# EAGLE schematic FPGA (EAGLE 9.1.3)
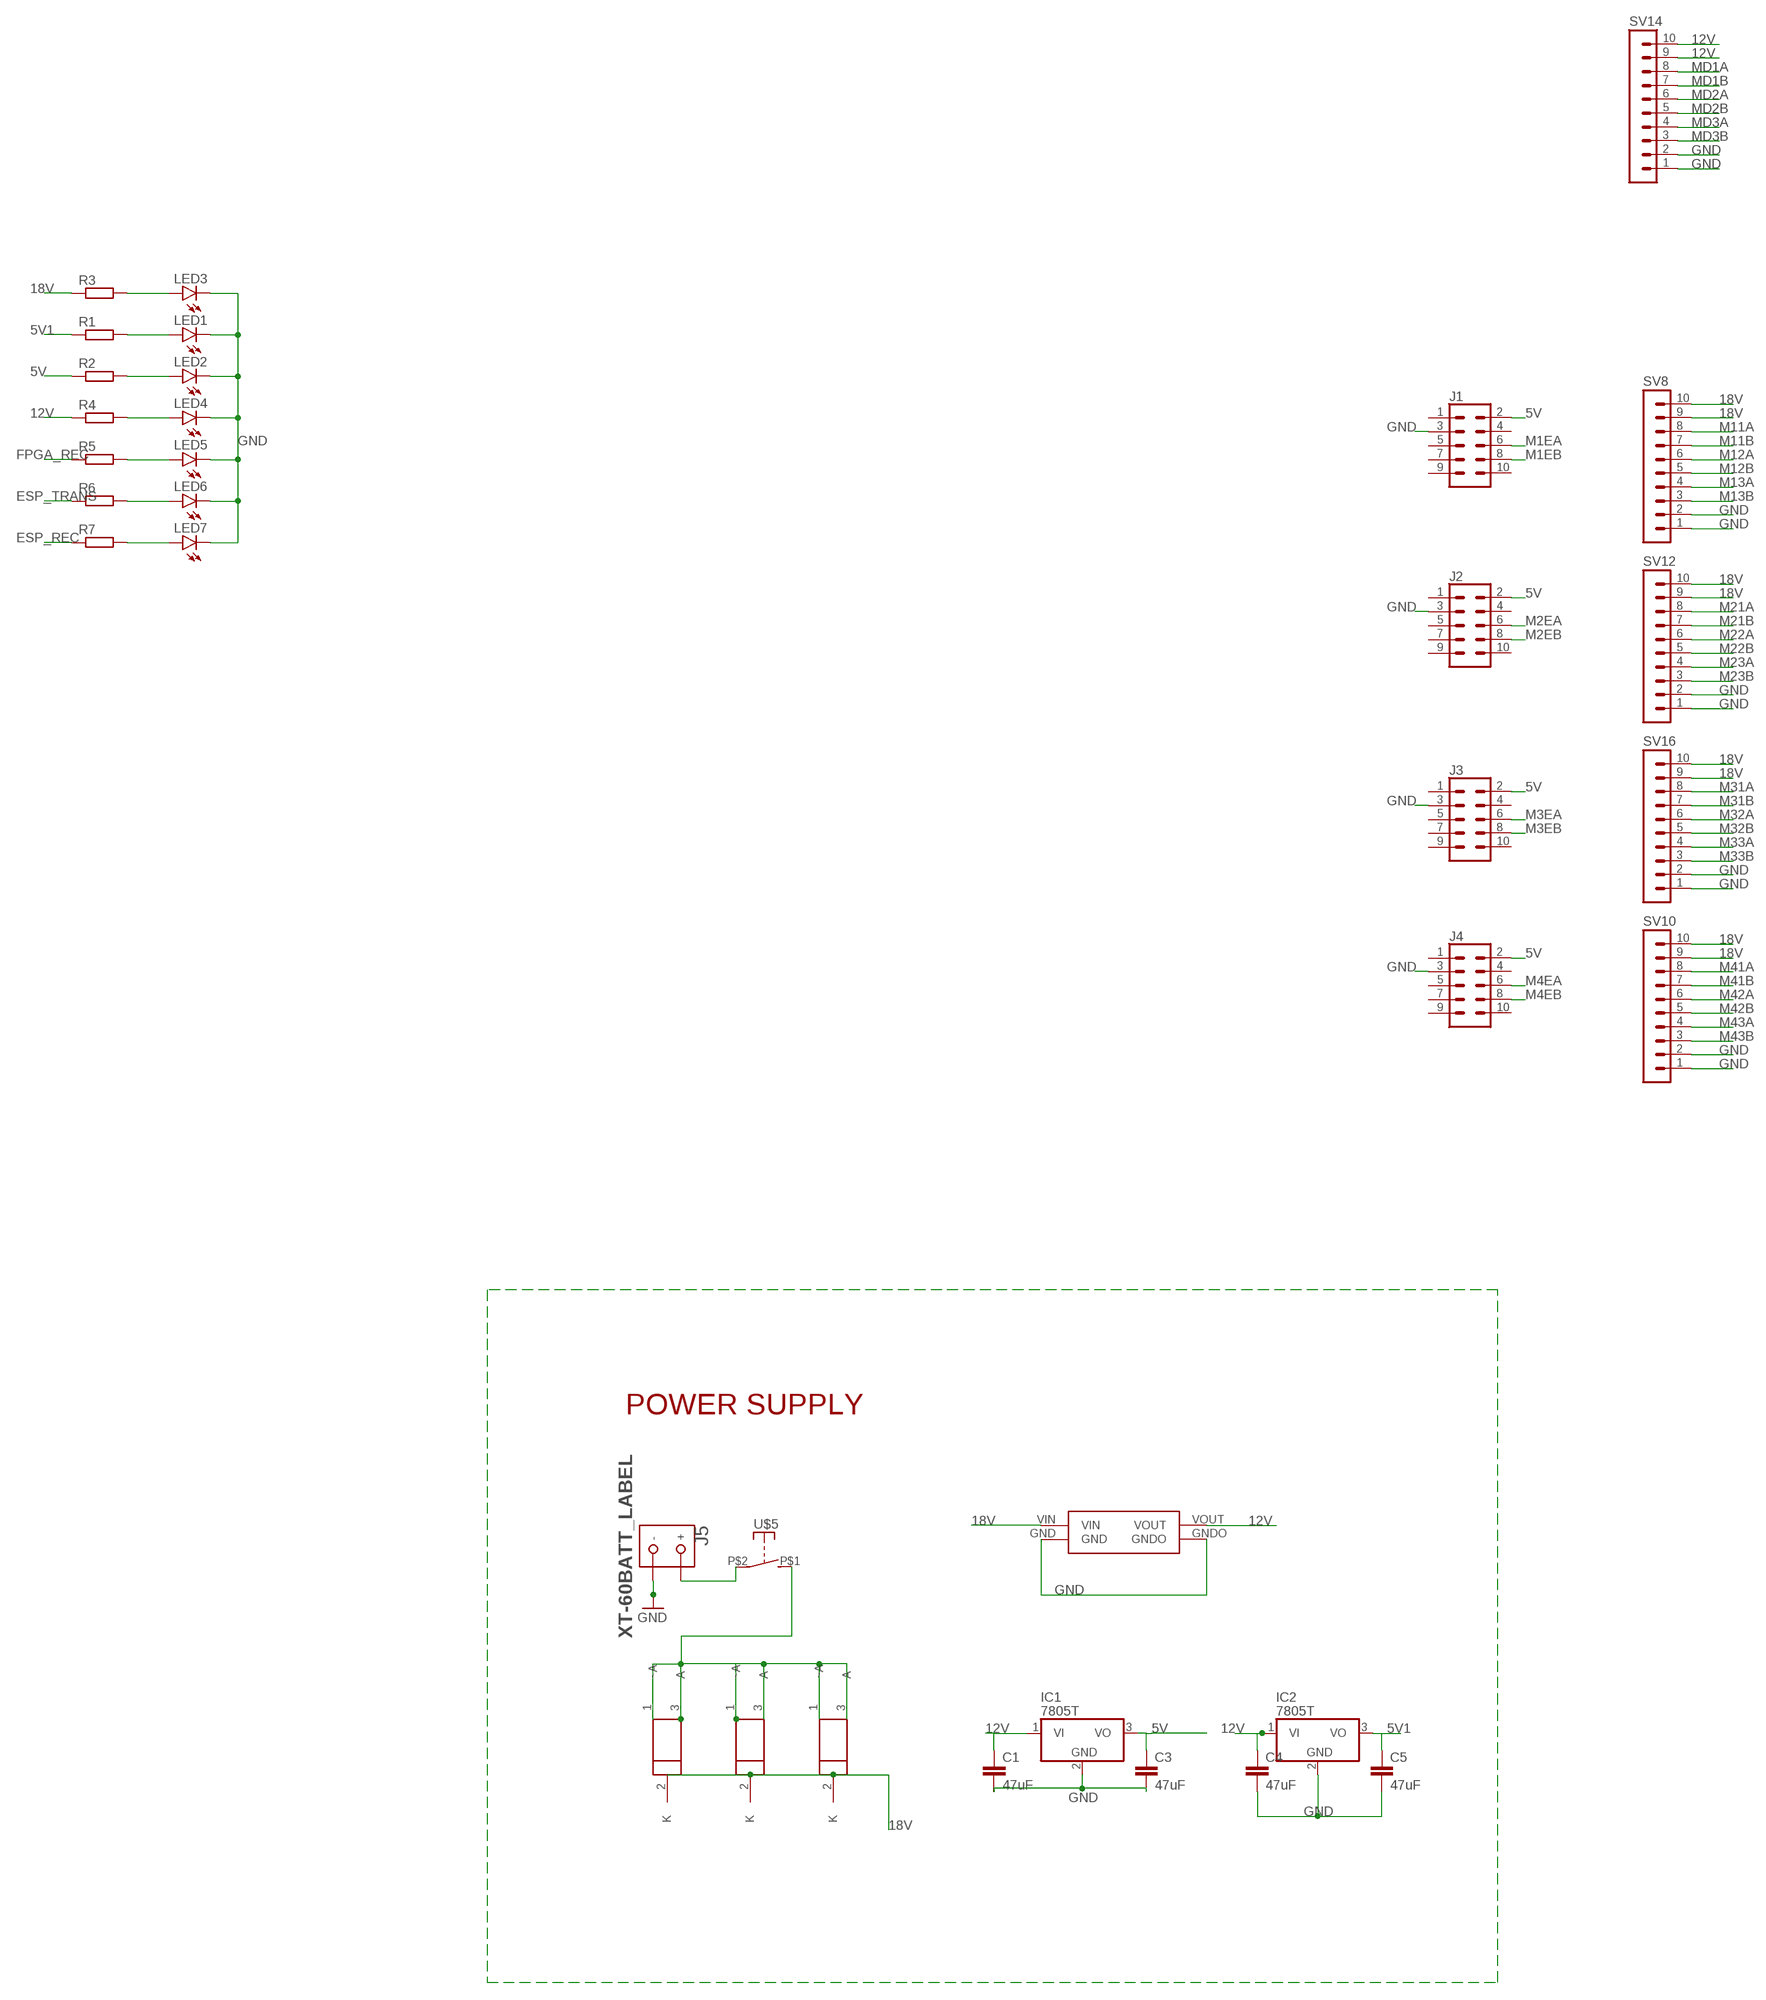
[diagram p0: schematic, sheet 1, part 1 of 2]
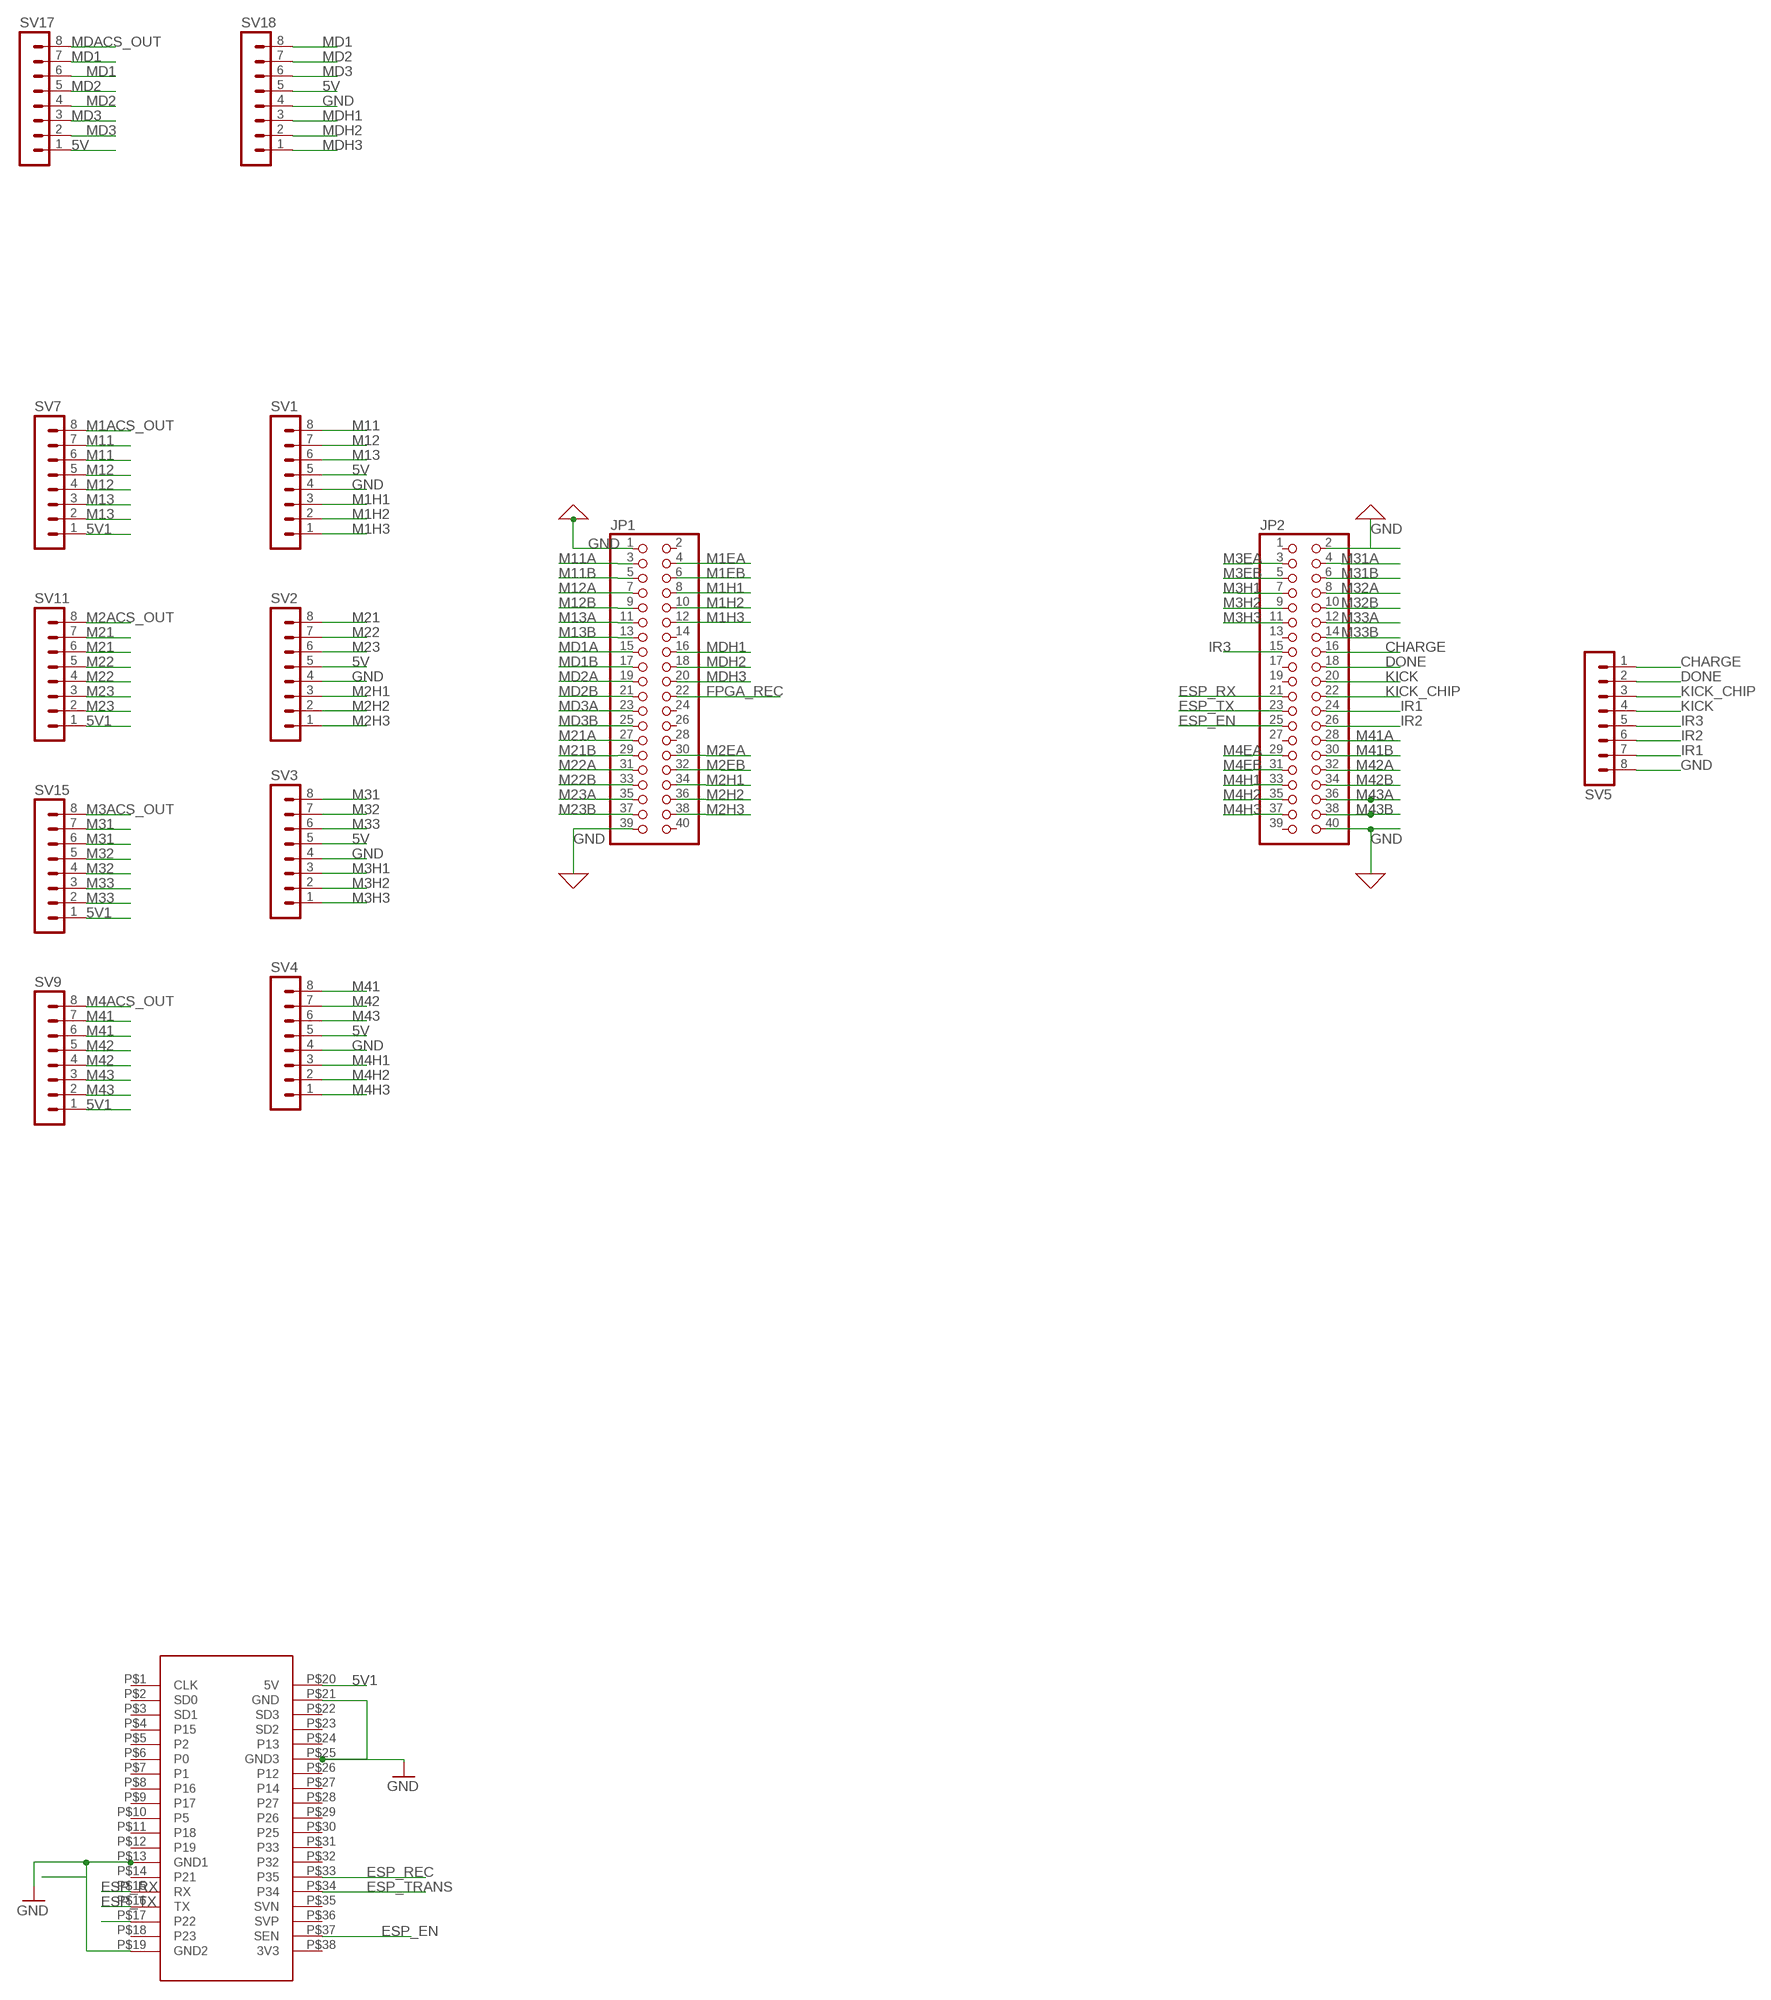
[diagram p1: schematic, sheet 1, part 2 of 2]

## Parts
C1  47uF  C-EUC1206  [C1206]
C3  47uF  C-EUC1206  [C1206]
C4  47uF  C-EUC1206  [C1206]
C5  47uF  C-EUC1206  [C1206]
IC1  7805T  [TO220H]
IC2  7805T  [TO220H]
J1  CONN_05X2SHD_LOCK  [2X5-SHROUDED_LOCK]
J2  CONN_05X2SHD_LOCK  [2X5-SHROUDED_LOCK]
J3  CONN_05X2SHD_LOCK  [2X5-SHROUDED_LOCK]
J4  CONN_05X2SHD_LOCK  [2X5-SHROUDED_LOCK]
J5  XT-60BATT_LABEL  [XT-60]
JP1  PINHD-2X20  [2X20]
JP2  PINHD-2X20  [2X20]
LED1  LEDSMT1206  [1206]
LED2  LEDSMT1206  [1206]
LED3  LEDSMT1206  [1206]
LED4  LEDSMT1206  [1206]
LED5  LEDSMT1206  [1206]
LED6  LEDSMT1206  [1206]
LED7  LEDSMT1206  [1206]
R1  R-EU_R1206  [R1206]
R2  R-EU_R1206  [R1206]
R3  R-EU_R1206  [R1206]
R4  R-EU_R1206  [R1206]
R5  R-EU_R1206  [R1206]
R6  R-EU_R1206  [R1206]
R7  R-EU_R1206  [R1206]
SV1  MA08-1  [MA08-1]
SV2  MA08-1  [MA08-1]
SV3  MA08-1  [MA08-1]
SV4  MA08-1  [MA08-1]
SV5  MA08-1  [MA08-1]
SV7  MA08-1  [MA08-1]
SV8  MA10-1  [MA10-1]
SV9  MA08-1  [MA08-1]
SV10  MA10-1  [MA10-1]
SV11  MA08-1  [MA08-1]
SV12  MA10-1  [MA10-1]
SV14  MA10-1  [MA10-1]
SV15  MA08-1  [MA08-1]
SV16  MA10-1  [MA10-1]
SV17  MA08-1  [MA08-1]
SV18  MA08-1  [MA08-1]
U1  LP38690DT-3.3  [TO228P1042X238-3N]
U2  LP38690DT-3.3  [TO228P1042X238-3N]
U3  LP38690DT-3.3  [TO228P1042X238-3N]
U$1  NODEMCU32S  [NODEMCU32]
U$4  BUCK  [BUCK]
U$5  SWITCH_DA10  [DA10]

## Nets
5V [5v]: C3.1 IC1.3(VO) J1.2 J2.2 J3.2 J4.2 R2.1 SV1.5 SV2.5 SV3.5 SV4.5 SV17.1 SV18.5
5V1 [5v]: C5.1 IC2.3(VO) R1.1 SV7.1 SV9.1 SV11.1 SV15.1 U$1.P$20(5V)
12V [18V]: C1.1 C4.1 IC1.1(VI) IC2.1(VI) R4.1 SV14.9 SV14.10 U$4.VOUT
18V [18V]: R3.1 SV8.9 SV8.10 SV10.9 SV10.10 SV12.9 SV12.10 SV16.9 SV16.10 U1.2(K) U2.2(K) U3.2(K) U$4.VIN
CHARGE: JP2.16 SV5.1
DONE: JP2.18 SV5.2
ESP_EN: JP2.25 U$1.P$37(SEN)
ESP_REC: R7.1 U$1.P$33(P35)
ESP_RX: JP2.21 U$1.P$15(RX)
ESP_TRANS: R6.1 U$1.P$34(P34)
ESP_TX: JP2.23 U$1.P$16(TX)
FPGA_REC: JP1.22 R5.1
GND [gnd]: C1.2 C3.2 C4.2 C5.2 IC1.2(GND) IC2.2(GND) J1.3 J2.3 J3.3 J4.3 J5.GND(-) JP1.1 JP1.39 JP2.2 JP2.40 LED1.C LED2.C LED3.C LED4.C LED5.C LED6.C LED7.C SV1.4 SV2.4 SV3.4 SV4.4 SV5.8 SV8.1 SV8.2 SV10.1 SV10.2 SV12.1 SV12.2 SV14.1 SV14.2 SV16.1 SV16.2 SV18.4 U$1.P$13(GND1) U$1.P$19(GND2) U$1.P$21(GND) U$1.P$25(GND3) U$4.GND U$4.GNDO
INPUT [VCKT]: U1.1(~A) U1.3(A) U2.1(~A) U2.3(A) U3.1(~A) U3.3(A) U$5.P$1(S)
IR1: JP2.24 SV5.7
IR2: JP2.26 SV5.6
IR3 [signal]: JP2.15 SV5.5
KICK: JP2.20 SV5.4
KICK_CHIP: JP2.22 SV5.3
M1ACS_OUT: SV7.8
M1EA: J1.6 JP1.4
M1EB: J1.8 JP1.6
M1H1: JP1.8 SV1.3
M1H2: JP1.10 SV1.2
M1H3: JP1.12 SV1.1
M2ACS_OUT: SV11.8
M2EA: J2.6 JP1.30
M2EB: J2.8 JP1.32
M2H1: JP1.34 SV2.3
M2H2: JP1.36 SV2.2
M2H3: JP1.38 SV2.1
M3ACS_OUT: SV15.8
M3EA: J3.6 JP2.3
M3EB: J3.8 JP2.5
M3H1: JP2.7 SV3.3
M3H2: JP2.9 SV3.2
M3H3: JP2.11 SV3.1
M4ACS_OUT: SV9.8
M4EA: J4.6 JP2.29
M4EB: J4.8 JP2.31
M4H1: JP2.33 SV4.3
M4H2: JP2.35 SV4.2
M4H3: JP2.37 SV4.1
M11 [motor]: SV1.8 SV7.6 SV7.7
M11A [signal]: JP1.3 SV8.8
M11B [signal]: JP1.5 SV8.7
M12 [motor]: SV1.7 SV7.4 SV7.5
M12A: JP1.7 SV8.6
M12B: JP1.9 SV8.5
M13 [motor]: SV1.6 SV7.2 SV7.3
M13A: JP1.11 SV8.4
M13B: JP1.13 SV8.3
M21 [motor]: SV2.8 SV11.6 SV11.7
M21A: JP1.27 SV12.8
M21B: JP1.29 SV12.7
M22 [motor]: SV2.7 SV11.4 SV11.5
M22A: JP1.31 SV12.6
M22B: JP1.33 SV12.5
M23 [motor]: SV2.6 SV11.2 SV11.3
M23A: JP1.35 SV12.4
M23B: JP1.37 SV12.3
M31 [motor]: SV3.8 SV15.6 SV15.7
M31A: JP2.4 SV16.8
M31B: JP2.6 SV16.7
M32 [motor]: SV3.7 SV15.4 SV15.5
M32A: JP2.8 SV16.6
M32B: JP2.10 SV16.5
M33 [motor]: SV3.6 SV15.2 SV15.3
M33A: JP2.12 SV16.4
M33B: JP2.14 SV16.3
M41 [motor]: SV4.8 SV9.6 SV9.7
M41A: JP2.28 SV10.8
M41B: JP2.30 SV10.7
M42 [motor]: SV4.7 SV9.4 SV9.5
M42A: JP2.32 SV10.6
M42B: JP2.34 SV10.5
M43 [motor]: SV4.6 SV9.2 SV9.3
M43A: JP2.36 SV10.4
M43B: JP2.38 SV10.3
MD1 [motor]: SV17.6 SV17.7 SV18.8
MD1A: JP1.15 SV14.8
MD1B: JP1.17 SV14.7
MD2 [motor]: SV17.4 SV17.5 SV18.7
MD2A: JP1.19 SV14.6
MD2B: JP1.21 SV14.5
MD3 [motor]: SV17.2 SV17.3 SV18.6
MD3A: JP1.23 SV14.4
MD3B: JP1.25 SV14.3
MDACS_OUT: SV17.8
MDH1: JP1.16 SV18.3
MDH2: JP1.18 SV18.2
MDH3: JP1.20 SV18.1
N$2: U$1.P$17(P22)
N$4: LED1.A R1.2
N$7: LED2.A R2.2
N$10: LED3.A R3.2
N$13: LED4.A R4.2
N$16: LED5.A R5.2
N$19: LED6.A R6.2
N$22: LED7.A R7.2
SUPP [VCKT]: J5.BATT(+) U$5.P$2(P)
Unconnected: J1.1 J1.4 J1.5 J1.7 J1.9 J1.10 J2.1 J2.4 J2.5 J2.7 J2.9 J2.10 J3.1 J3.4 J3.5 J3.7 J3.9 J3.10 J4.1 J4.4 J4.5 J4.7 J4.9 J4.10 JP1.2 JP1.14 JP1.24 JP1.26 JP1.28 JP1.40 JP2.1 JP2.13 JP2.17 JP2.19 JP2.27 JP2.39 U$1.P$1(CLK) U$1.P$2(SD0) U$1.P$3(SD1) U$1.P$4(P15) U$1.P$5(P2) U$1.P$6(P0) U$1.P$7(P1) U$1.P$8(P16) U$1.P$9(P17) U$1.P$10(P5) U$1.P$11(P18) U$1.P$12(P19) U$1.P$14(P21) U$1.P$18(P23) U$1.P$22(SD3) U$1.P$23(SD2) U$1.P$24(P13) U$1.P$26(P12) U$1.P$27(P14) U$1.P$28(P27) U$1.P$29(P26) U$1.P$30(P25) U$1.P$31(P33) U$1.P$32(P32) U$1.P$35(SVN) U$1.P$36(SVP) U$1.P$38(3V3)

## Notes on the sheet
- POWER SUPPLY

## Library data of the parts
C1 C3-C5 = rcl:C-EU: CAPACITOR, European symbol
IC1 IC2 = linear:78*: Positive VOLTAGE REGULATOR Source: http://cache.national.com/ds/LM/LM78L05.pdf http://www.fairchildsemi.com/ds/LM/LM7805.pdf
J1-J4 = SparkFun-Connectors:CONN_05X2: Multi connection point. Often used as Generic Header-pin footprint for 0.1 inch spaced/style header connections For AVR SPI programming port, see special device with nice symbol: "AVR_SPI_PROG_5x2.dev" You can populate with any combo of single row headers, but if you'd like an exact match, check these: 2x5 AVR ICSP Male Header <https://www.sparkfun.com/products/778> (PRT-00778) 2x5 Pin Shrouded Header <https://www.sparkfun.com/products/8506> (PRT-08506) On any of the 0.1 inch spaced packages, you can populate with these: Break Away Headers - Straight <https://www.sparkfun.com/products/116> (PRT-00116) Break Away Male Headers - Right Angle <https://www.sparkfun.com/products/553> (PRT-00553) Female Headers <https://www.sparkfun.com/products/115> (PRT-00115) Break Away Headers - Machine Pin <https://www.sparkfun.com/products/117> (PRT-00117) Break Away Female Headers - Swiss Machine Pin <https://www.sparkfun.com/products/743> (PRT-00743) Special note: the shrouded connector mates well with our 5x2 ribbon cables: 2x5 Pin IDC Ribbon Cable <https://www.sparkfun.com/products/8535> (PRT-08535); PROD_ID: CONN-08671; SF_ID: PRT-08506
J5 = RoboJackets-Connectors:XT-60: XT-60 Power Connector Distributor: HobbyKing <http://www.hobbyking.com/hobbyking/store/RC_PRODUCT_SEARCH.asp?strSearch=xt-60>
JP1 JP2 = pinhead:PINHD-2X20: PIN HEADER
LED1-LED7 = led:LED: LED OSRAM: - CHIPLED LG R971, LG N971, LY N971, LG Q971, LY Q971, LO R971, LY R971 LH N974, LH R974 LS Q976, LO Q976, LY Q976 LO Q996 - Hyper CHIPLED LW Q18S LB Q993, LB Q99A, LB R99A - SideLED LS A670, LO A670, LY A670, LG A670, LP A670 LB A673, LV A673, LT A673, LW A673 LH A674 LY A675 LS A676, LA A676, LO A676, LY A676, LW A676 LS A679, LY A679, LG A679 - Hyper Micro SIDELED® LS Y876, LA Y876, LO Y876, LY Y876 LT Y87S - SmartLED LW L88C, LW L88S LB L89C, LB L89S, LG L890 LS L89K, LO L89K, LY L89K LS L896, LA L896, LO L896, LY L896 - TOPLED LS T670, LO T670, LY T670, LG T670, LP T670 LSG T670, LSP T670, LSY T670, LOP T670, LYG T670 LG T671, LOG T671, LSG T671 LB T673, LV T673, LT T673, LW T673 LH T674 LS T676, LA T676, LO T676, LY T676, LB T676, LH T676, LSB T676, LW T676 LB T67C, LV T67C, LT T67C, LS T67K, LO T67K, LY T67K, LW E67C LS E67B, LA E67B, LO E67B, LY E67B, LB E67C, LV E67C, LT E67C LW T67C LS T679, LY T679, LG T679 LS T770, LO T770, LY T770, LG T770, LP T770 LB T773, LV T773, LT T773, LW T773 LH T774 LS E675, LA E675, LY E675, LS T675 LS T776, LA T776, LO T776, LY T776, LB T776 LHGB T686 LT T68C, LB T68C - Hyper Mini TOPLED® LB M676 - Mini TOPLED Santana® LG M470 LS M47K, LO M47K, LY M47K Source: http://www.osram.convergy.de LUXEON: - LUMILED® LXK2-PW12-R00, LXK2-PW12-S00, LXK2-PW14-U00, LXK2-PW14-V00 LXK2-PM12-R00, LXK2-PM12-S00, LXK2-PM14-U00 LXK2-PE12-Q00, LXK2-PE12-R00, LXK2-PE12-S00, LXK2-PE14-T00, LXK2-PE14-U00 LXK2-PB12-K00, LXK2-PB12-L00, LXK2-PB12-M00, LXK2-PB14-N00, LXK2-PB14-P00, LXK2-PB14-Q00 LXK2-PR12-L00, LXK2-PR12-M00, LXK2-PR14-Q00, LXK2-PR14-R00 LXK2-PD12-Q00, LXK2-PD12-R00, LXK2-PD12-S00 LXK2-PH12-R00, LXK2-PH12-S00 LXK2-PL12-P00, LXK2-PL12-Q00, LXK2-PL12-R00 Source: www.luxeon.com KINGBRIGHT: KA-3528ASYC Source: www.kingbright.com
R1-R7 = resistor:R-EU_: RESISTOR, European symbol
SV1-SV5 SV7 SV9 SV11 SV15 SV17 SV18 = con-lstb:MA08-1: PIN HEADER; OC_FARNELL: unknown; OC_NEWARK: unknown
SV8 SV10 SV12 SV14 SV16 = con-lstb:MA10-1: PIN HEADER; OC_FARNELL: unknown; OC_NEWARK: unknown
U1-U3 = LP38690DT-3.3:LP38690DT-3.3; MPN: LP38690DT-3.3; OC_FARNELL: 1008048; OC_NEWARK: 41K7439; PACKAGE: TO-252; SUPPLIER: National Semiconductor
U$1 = nodeMCU:NODEMCU32S
U$4 = BUCK:BUCK
U$5 = switch_DA10:SWITCH_DA10

## Net classes
0 signal1: width 0.3 mm, drill 0.4 mm, clearance 0.2 mm
1 5v: width 0.4 mm, drill 0.4 mm, clearance 0.2 mm
2 18V: width 1.2 mm, drill 1.3 mm, clearance 0.2 mm
3 signal: width 0.3 mm, drill 0.4 mm, clearance 0.2 mm
4 gnd: width 0.3 mm, drill 0.4 mm, clearance 0.2 mm
5 VCKT: width 4 mm, drill 4 mm, clearance 0.2 mm
6 motor: width 0.8 mm, drill 1 mm, clearance 0.2 mm